# Altium project Audio_Moduloop.PrjPcb (part 1 of 2)
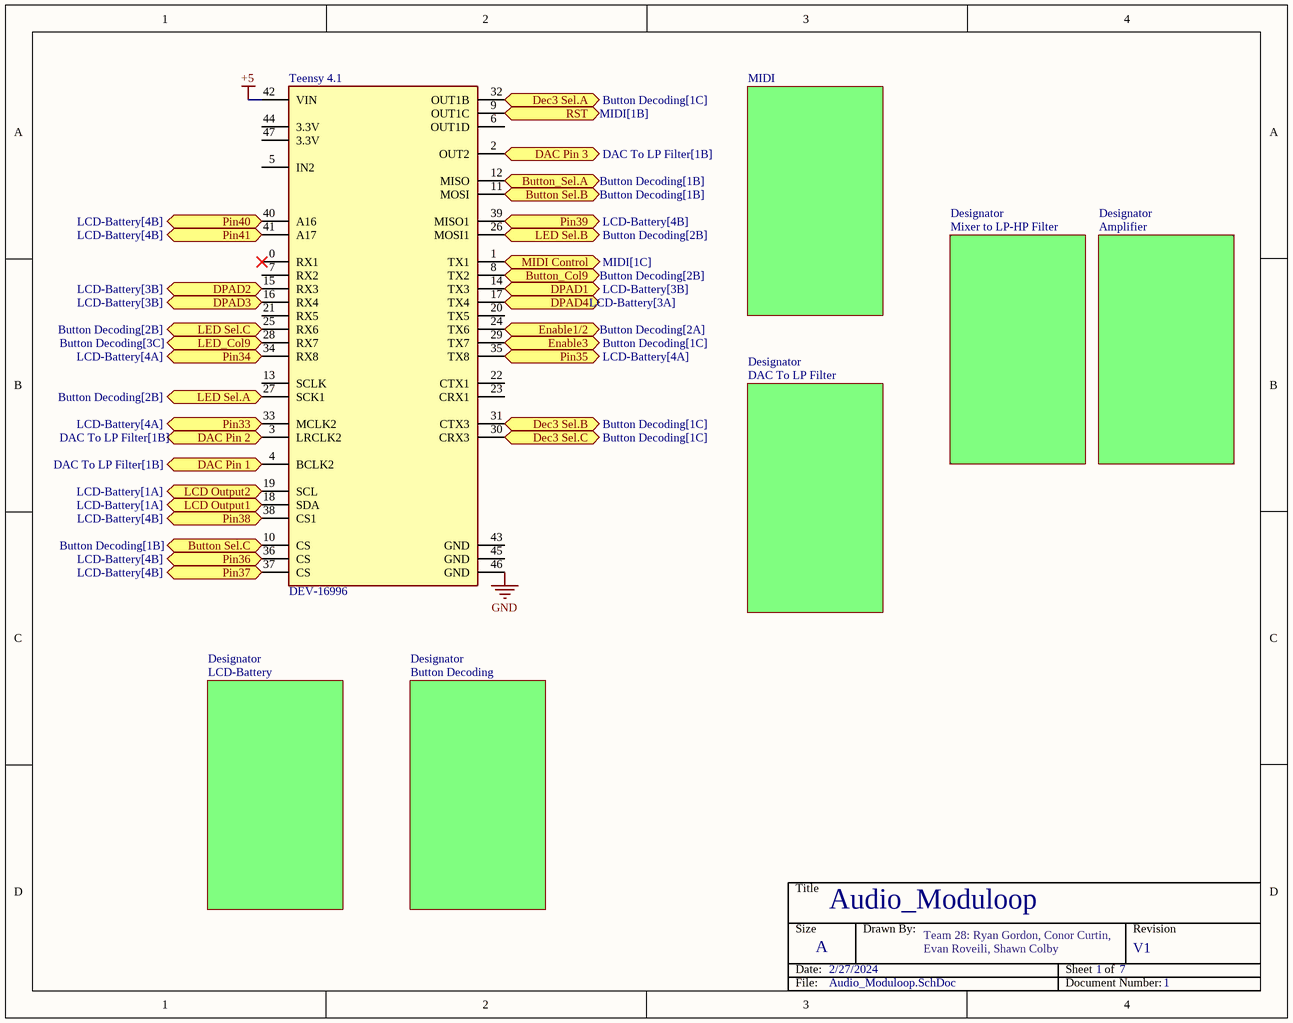
[diagram p0: Audio_Moduloop.SchDoc]
7 sheets, 101 parts. Net scope: flat (ports and power ports of the same name join across sheets).
Board file: Audio_PCB.PcbDoc
Sheets:
  Audio_Moduloop.SchDoc
    MIDI = MIDI.SchDoc
    Designator = Amplifier.SchDoc
    Designator = DAC To LP Filter.SchDoc
    Designator = Button Decoding.SchDoc
    Designator = LCD-Battery.SchDoc
    Designator = Mixer to LP-HP Filter.SchDoc

## Sheet Audio_Moduloop.SchDoc: Audio_Moduloop
size A; Date: 2/27/2024; DrawnBy: Team 28: Ryan Gordon, Conor Curtin, Evan Roveili, Shawn Colby; DocumentNumber: 1; Revision: V1; SheetNumber: 1; SheetTotal: 7

### Parts
Teensy_4.1  DEV-16996  [FP-DEV-16996-MFG]

### Sub-sheets
Designator = Amplifier: no entries
Designator = DAC To LP Filter: no entries
Designator = Button Decoding: no entries
Designator = LCD-Battery: no entries
Designator = Mixer to LP-HP Filter: no entries
MIDI = MIDI: no entries

### Ports
Button Sel.B (bidir, see Button Decoding[1B]), Button Sel.C (bidir, see Button Decoding[1B]), Button_Col9 (bidir, see Button Decoding[2B]), Button_Sel.A (bidir, see Button Decoding[1B]), DAC Pin 1 (bidir, see DAC To LP Filter[1B]), DAC Pin 2 (bidir, see DAC To LP Filter[1B]), DAC Pin 3 (bidir, see DAC To LP Filter[1B]), Dec3 Sel.A (bidir, see Button Decoding[1C]), Dec3 Sel.B (bidir, see Button Decoding[1C]), Dec3 Sel.C (bidir, see Button Decoding[1C]), DPAD1 (bidir, see LCD-Battery[3B]), DPAD2 (bidir, see LCD-Battery[3B]), DPAD3 (bidir, see LCD-Battery[3B]), DPAD4 (bidir, see LCD-Battery[3A]), Enable1/2 (bidir, see Button Decoding[2A]), Enable3 (bidir, see Button Decoding[1C]), LCD Output1 (bidir, see LCD-Battery[1A]), LCD Output2 (bidir, see LCD-Battery[1A]), LED Sel.A (bidir, see Button Decoding[2B]), LED Sel.B (bidir, see Button Decoding[2B]), LED Sel.C (bidir, see Button Decoding[2B]), LED_Col9 (bidir, see Button Decoding[3C]), MIDI Control (bidir, see MIDI[1C]), Pin33 (bidir, see LCD-Battery[4A]), Pin34 (bidir, see LCD-Battery[4A]), Pin35 (bidir, see LCD-Battery[4A]), Pin36 (bidir, see LCD-Battery[4B]), Pin37 (bidir, see LCD-Battery[4B]), Pin38 (bidir, see LCD-Battery[4B]), Pin39 (bidir, see LCD-Battery[4B]), Pin40 (bidir, see LCD-Battery[4B]), Pin41 (bidir, see LCD-Battery[4B]), RST (bidir, see MIDI[1B])

### Nets
+5: Teensy_4.1.42(VIN)
GND: Teensy_4.1.46(GND)
NetBut._Col_9: Teensy_4.1.8(TX2) ; port Button_Col9
NetDec1_1: Teensy_4.1.12(MISO) ; port Button_Sel.A
NetDec1_2: Teensy_4.1.11(MOSI) ; port Button Sel.B
NetDec1_3: Teensy_4.1.10(CS) ; port Button Sel.C
NetDec1_6: Teensy_4.1.24(TX6) ; port Enable1/2
NetDec2_1: Teensy_4.1.27(SCK1) ; port LED Sel.A
NetDec2_2: Teensy_4.1.26(MOSI1) ; port LED Sel.B
NetDec2_3: Teensy_4.1.25(RX6) ; port LED Sel.C
NetDec3_1: Teensy_4.1.32(OUT1B) ; port Dec3 Sel.A
NetDec3_2: Teensy_4.1.31(CTX3) ; port Dec3 Sel.B
NetDec3_3: Teensy_4.1.30(CRX3) ; port Dec3 Sel.C
NetDec3_6: Teensy_4.1.29(TX7) ; port Enable3
NetLCD1_1: Teensy_4.1.19(SCL) ; port LCD Output2
NetLCD1_2: Teensy_4.1.18(SDA) ; port LCD Output1
NetLED_Col_9: Teensy_4.1.28(RX7) ; port LED_Col9
NetMenu_Input_5: Teensy_4.1.17(TX4) ; port DPAD4
NetMenu_Input_6: Teensy_4.1.16(RX4) ; port DPAD3
NetMenu_Input_7: Teensy_4.1.15(RX3) ; port DPAD2
NetMenu_Input_8: Teensy_4.1.14(TX3) ; port DPAD1
NetMIDI_Chip_1: Teensy_4.1.9(OUT1C) ; port RST
NetMIDI_Chip_15: Teensy_4.1.1(TX1) ; port MIDI Control
NetPT2811_1: Teensy_4.1.4(BCLK2) ; port DAC Pin 1
NetPT2811_2: Teensy_4.1.3(LRCLK2) ; port DAC Pin 2
NetPT2811_3: Teensy_4.1.2(OUT2) ; port DAC Pin 3
NetTeensy_4.1_33: Teensy_4.1.33(MCLK2) ; port Pin33
NetTeensy_4.1_34: Teensy_4.1.34(RX8) ; port Pin34
NetTeensy_4.1_35: Teensy_4.1.35(TX8) ; port Pin35
NetTeensy_4.1_36: Teensy_4.1.36(CS) ; port Pin36
NetTeensy_4.1_37: Teensy_4.1.37(CS) ; port Pin37
NetTeensy_4.1_38: Teensy_4.1.38(CS1) ; port Pin38
NetTeensy_4.1_39: Teensy_4.1.39(MISO1) ; port Pin39
NetTeensy_4.1_40: Teensy_4.1.40(A16) ; port Pin40
NetTeensy_4.1_41: Teensy_4.1.41(A17) ; port Pin41

Not connected (* = marked no-connect by the designer): Teensy_4.1 0(RX1)* 5(IN2) 6(OUT1D) 7(RX2) 13(SCLK) 20(TX5) 21(RX5) 22(CTX1) 23(CRX1) 43(GND) 44(3.3V) 45(GND) 47(3.3V)

### Notes on the sheet
- Title
- Size
- Date:
- A
- Drawn By:
- Sheet    of
- Revision
- File:
- Document Number:

### Library data of the parts
Teensy_4.1 = CMP-157412-000001-1: TEENSY 4.1 (HEADERS)

## Sheet MIDI.SchDoc: Audio_Moduloop - MIDI
size A; Date: 2/27/2024; DrawnBy: Team 28: Ryan Gordon, Conor Curtin, Evan Roveili, Shawn Colby; DocumentNumber: 2; Revision: V1; SheetNumber: 2; SheetTotal: 7
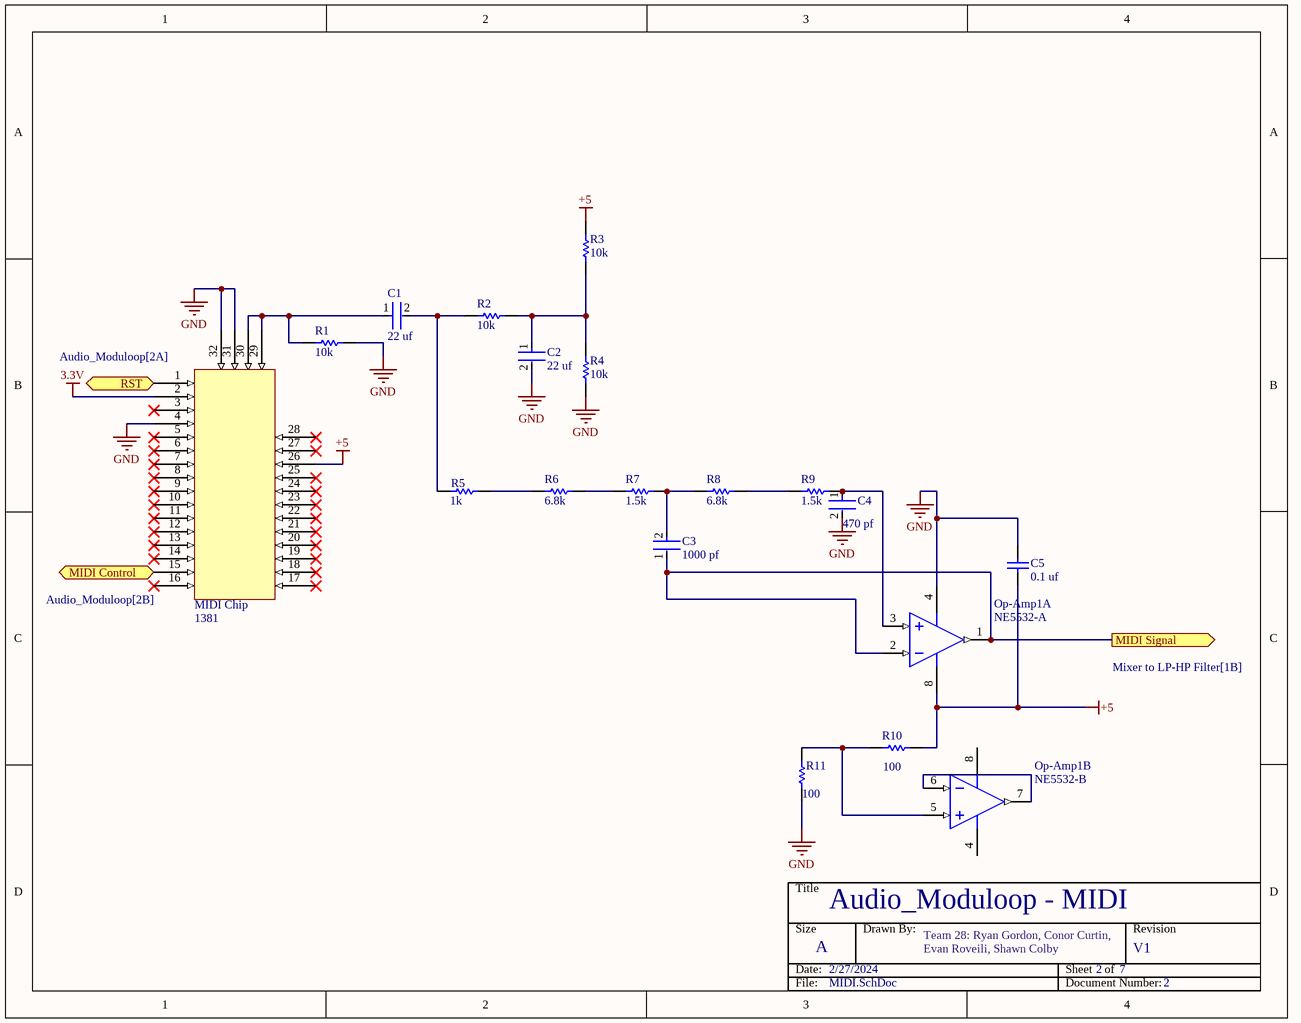
[diagram p1: MIDI.SchDoc]

### Parts
C1  22 uf  [FP-RCEWM1-MFG]
C2  22 uf  [FP-RCEWM1-MFG]
C3  1000 pf  [FP-VY1102M35Y5UQ6TV0-MFG]
C4  470 pf  [FP-F471K33Y5RP6UK5R-MFG]
C5  0.1 uf  [AVX-SA115C104KAR]
MIDI_Chip  1381  [FEATHERWING]
Op-Amp1  NE5532-A  [ONSC-SOIC-8-751-07_V]  (parts A,B of 2)
R1  10k  [RESC2013X60X35NL10T20]
R2  10k  [RESC2013X60X35NL10T20]
R3  10k  [RESC2013X60X35NL10T20]
R4  10k  [RESC2013X60X35NL10T20]
R5  1k  [RESC2013X70X40ML20T20]
R6  6.8k  [RESC2013X70X40LL20T20]
R7  1.5k  [RESC2013X60X40LL20T25]
R8  6.8k  [RESC2013X70X40LL20T20]
R9  1.5k  [RESC2013X60X40LL20T25]
R10  100  [RESC2013X60X40ML20T25]
R11  100  [RESC2013X60X40ML20T25]

### Ports
MIDI Control (bidir, see Audio_Moduloop[2B]), MIDI Signal (out, see Mixer to LP-HP Filter[1B]), RST (bidir, see Audio_Moduloop[2A])

### Nets
3.3V: MIDI_Chip.2
+5: C5.1 MIDI_Chip.26 Op-Amp1.8(V+) R3.1 R10.2
GND: C2.2 C4.2 C5.2 MIDI_Chip.4 MIDI_Chip.31 MIDI_Chip.32 Op-Amp1.4(V-) R1.2 R4.2 R11.1
NetC1_1: C1.1 MIDI_Chip.29 MIDI_Chip.30 R1.1
NetC1_2: C1.2 R2.1 R5.1
NetC2_1: C2.1 R2.2 R3.2 R4.1
NetC3_1: C3.1 Op-Amp1.1(OUTA) Op-Amp1.2(INA-) ; port MIDI Signal
NetC3_2: C3.2 R7.2 R8.1
NetC4_1: C4.1 Op-Amp1.3(INA+) R9.2
NetMIDI_Chip_1: MIDI_Chip.1 ; port RST
NetMIDI_Chip_15: MIDI_Chip.15 ; port MIDI Control
NetOp-Amp1_5: Op-Amp1.5(INB+) R10.1 R11.2
NetOp-Amp1_6: Op-Amp1.6(INB-) Op-Amp1.7(OUTB)
NetR5_2: R5.2 R6.1
NetR6_2: R6.2 R7.1
NetR8_2: R8.2 R9.1

Not connected (* = marked no-connect by the designer): MIDI_Chip 3* 5* 6* 7* 8* 9* 10* 11* 12* 13* 14* 16* 17* 18* 19* 20* 21* 22* 23* 24* 25* 27* 28*

### Notes on the sheet
- Title
- Size
- Date:
- A
- Drawn By:
- Sheet    of
- Revision
- File:
- Document Number:

### Library data of the parts
C1 C2 = CMP-06035-003622-1: CAP CER 22UF 25V X7R RADIAL; Tolerance: 20%; Lead Diameter: 0.5mm; Lead/Base Style: Formed Leads; Height - Seated (Max): 0.295inch; Height: 7.5mm; Capacitance: 22uF; Max Operating Temperature: 125°C; Package Quantity: 1500; Case/Package: Radial; Length: 0.217inch; Lead Pitch: 0.197inch; Voltage Rating (DC): 25V; Ratings: AEC-Q200; Mount: Through Hole; Packaging: Tape and Reel; Voltage Rating: 25V; Min Operating Temperature: -55°C; Width: 0.157inch; Resistor Type: Ceramic; Termination: Radial; Dielectric: X7R
C3 = CMP-02417-000063-1: CAP CER 1000PF 760VAC Y5U RADIAL; Voltage: 500V; Capacitance: 1nF; Lead Diameter: 0.6mm; Lead/Base Style: Kinked; Tolerance: 20%; Construction: RADIAL; Dielectric: Y5U; RoHS Compliant: Yes; Resistor Type: Ceramic; Min Operating Temperature: -40°C; Height - Seated (Max): 0.512inch; Series: VY1; Diameter: 9mm; Voltage Rating (AC): 500V; Termination: Radial; Depth: 5mm; Radiation Hardening: No; Lead Pitch: 10mm; Package Quantity: 500; Case/Package: Radial; Height: 12mm; Contact Plating: Tin; Voltage Rating (DC): 500V; Max Operating Temperature: 125°C; Packaging: Tape and Reel; Mount: Through Hole
C4 = CMP-02417-000080-1: CAP CER 470PF 2KV Y5R RADIAL; Tolerance: 10%; Dielectric Material: Ceramic; Insulation Resistance: 10GR; Lead/Base Style: Kinked; Lead Diameter: 0.8mm; Series: F; Depth: 5mm; Package Quantity: 1500; Resistor Type: Ceramic; Construction: RADIAL; Min Operating Temperature: -30°C; Mount: Through Hole; Radiation Hardening: No; Voltage: 2kV; Voltage Rating: 2kV; Max Operating Temperature: 125°C; Termination: Radial; RoHS Compliant: Yes; Lead Pitch: 5mm; Capacitance: 470pF; Packaging: Tape and Reel; Length: 8.5mm; Case/Package: Radial; Dielectric: Y5R
C5 = CMP-2000-07029-1: Axial Leads / SpinGuard(R), Ceramic Capacitor, 0.10 uF +/- 10%, 50V, -55 to 125 degC, 2-Pin THD, RoHS, Tape and Reel; Manufacturer: AVX; Other Names: 478-3151-1; Catalog Drawings: SASeries_4.32x3.05; Capacitance: 0.1µF; Temperature Coefficient: X7R; Online Catalog: SpinGuard®SASeries; Product Training Modules: ComponentSolutionsforSmartMeterApplications; Category: Capacitors; Package Description: 2-Pin Axial Lead, Dia 3.05 mm, Body Length 4.32 mm; Standard Package: 1; Mounting Technology: ThroughHole; Ratings: -; Datasheet Version: 06/2007; Voltage - Rated: 50V; Tolerance: ±10%; Package Reference: SA115C104KAR; Packaging: -; Lead Style: -; Size / Dimension: 0.120"Diax0.170"L(3.05mmx4.32mm); Mounting Type: ThroughHole; Operating Temperature: -55°C~125°C; Datasheet URL: https://datasheet.ciiva.com/27051/1074183-27051369.pdf; Applications: GeneralPurpose; Thickness (Max): -; Lead Spacing: -; Height - Seated (Max): -; Family: CeramicCapacitors; Package / Case: Axial; Features: -; Series: SpinGuard®SA; Manufacturer URL: http://www.avx.com/
MIDI_Chip = CMP-00030-00003-3: Conn, Rect, PowerPoleHousing, PP180Series, Blue, 180A, 600V; Pins: 32
Op-Amp1 = CMP-1310-00252-1: Internally Compensated Dual Low Noise Operational Amplifier, 6 to 40 V, 0 to 70 degC, 8-Pin SOIC, Pb-Free, Tape and Reel; Manufacturer: On Semiconductor; PartNumber: NE5532AD8R2G; SR Typ (V/uS): 9; VCC Min (V): 6; VCC Max (V): 40; GBW Typ (MHz): 10; PackageVersion: Rev. AK, 02/2011; ComponentLink2URL: http://www.onsemi.cn/pub_link/Collateral/NE5532-D.PDF; RoHS: TRUE; PackageReference: SOIC-8-751-07; ComponentLink2Description: Datasheet; PackageDescription: 8-Pin Small Outline Integrated Circuit, Body 4.9 x 3.9 mm, Pitch 1.27 mm; ComponentLink3URL: http://www.onsemi.com/pub_link/Collateral/751-07.PDF; ComponentLink1Description: Manufacturer URL; DatasheetVersion: Rev. 2; Packing: Tape and Reel; ComponentLink1URL: http://www.onsemi.com/; ComponentLink3Description: Package Specification; Mounting Technology: Surface Mount
R1-R4 = CMP-1659-00013-4: Chip Resistor, 10 KOhm, +/- 1%, 0.125 W, -55 to 155 degC, 0805 (2012 Metric), RoHS, Tape and Reel; Manufacturer: Yageo; Voltage Rating: 150 V; Mount: Surface Mount; ComponentLink1Description: Manufacturer URL; ComponentLink2URL: http://www.yageo.com/documents/recent/PYu-RC_Group_51_RoHS_L_04.pdf; Pins: 2; Length: 2 mm; Min Operating Temperature: -55 degC; Height: 0.5 mm; Mounting Technology: Surface Mount; RoHSCompliant: true; REACH SVHC: No SVHC; ComponentLink1URL: http://www.yageo.com/; Max Operating Temperature: 155 degC; PackageReference: 0805; DatasheetVersion: Rev. 4, 02/2016; Package Quantity: 5000; Packaging: Tape and Reel; ComponentLink2Description: Datasheet; PackageDescription: 2-Pin Surface Mounted Device, Body 2 x 1.25 mm
R5 = CMP-2001-04375-5: Chip Resistor, 1 KOhm, +/- 1%, 0.125 W, -55 to 155 degC, 0805 (2012 Metric), RoHS, Tape and Reel; Manufacturer: Panasonic; Voltage Rating: 150 V; ComponentLink1URL: http://www.panasonic.com/; ComponentLink2Description: Datasheet; REACH SVHC: Yes; ComponentLink1Description: Manufacturer URL; Length: 2 mm; Height: 0.6 mm; Package Quantity: 1; PackageDescription: 2-Pin Surface Mount Device, Body 2 x 1.25 mm; Packaging: Cut Tape; PackageReference: 0805; Max Operating Temperature: 155 degC; Mounting Technology: Surface Mount; ComponentLink2URL: http://industrial.panasonic.com/cdbs/www-data/pdf/RDA0000/AOA0000C86.pdf; DatasheetVersion: 04/2015; Min Operating Temperature: -55 degC; RoHSCompliant: true; Mount: Surface Mount
R6 R8 = CMP-2001-00567-1: Manufacturer: Panasonic; Part Number: ERJ6ENF6801V
R7 R9 = CMP-2001-00597-1: Manufacturer: Panasonic; Part Number: ERA6AEB152V
R10 R11 = CMP-2001-00580-1: Manufacturer: Panasonic; Part Number: ERA6AEB101V

## Sheet Amplifier.SchDoc: Audio_Moduloop - Amplifier
size A; Date: 2/27/2024; DrawnBy: Team 28: Ryan Gordon, Conor Curtin, Evan Roveili, Shawn Colby; DocumentNumber: 5; Revision: V1; SheetNumber: 5; SheetTotal: 7
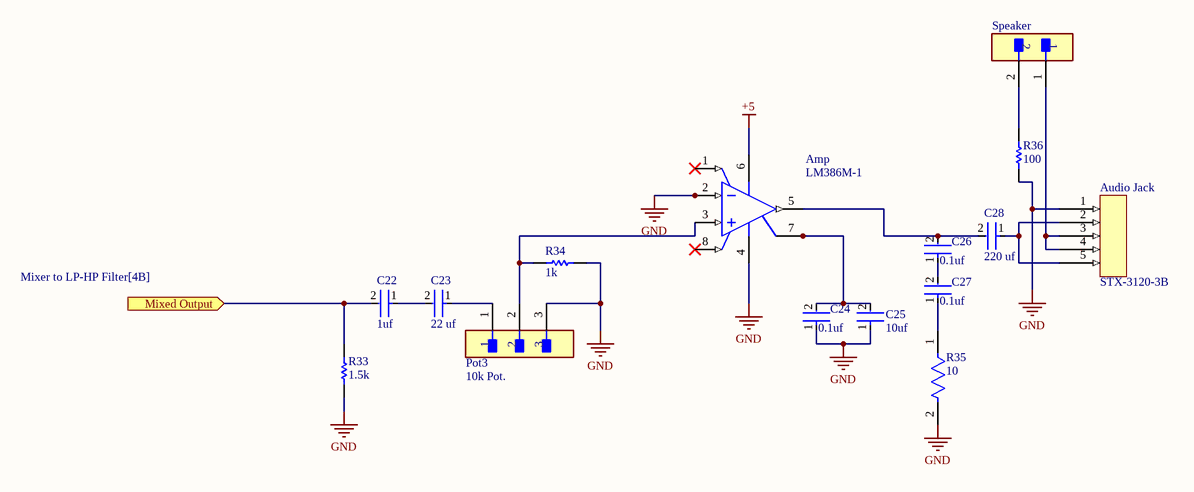
[diagram p2: Amplifier.SchDoc]

### Parts
Amp  LM386M-1  [TI-D8_M]
Audio_Jack  STX-3120-3B  [STX3100]
C22  1uf  [FP-K105Z20Y5VF5TL2-MFG]
C23  22 uf  [FP-RCEWM1-MFG]
C24  0.1uf  [FP-SR20-MFG]
C25  10uf  [FP-RCE3DB-MFG]
C26  0.1uf  [FP-SR20-MFG]
C27  0.1uf  [FP-SR20-MFG]
C28  220 uf  [FP-RCEWM1-MFG]
Pot3  10k Pot.  [FP-90120-0123-MFG]
R33  1.5k  [RESC2013X60X40LL20T25]
R34  1k  [RESC2013X70X40ML20T20]
R35  10  [FP-RN732A-MFG]
R36  100  [RESC2013X60X40ML20T25]
Speaker  M20-9990246  [FP-M20-9990246-MFG]  (value not drawn)

### Ports
Mixed Output (in, see Mixer to LP-HP Filter[4B])

### Nets
+5: Amp.6(VS)
GND: Amp.2(IN-) Amp.4(GND) Audio_Jack.1 C24.1 C25.1 Pot3.3 R33.1 R34.2 R35.2 R36.1
NetAmp_3: Amp.3(IN+) Pot3.2 R34.1
NetAmp_5: Amp.5(VOUT) C26.2 C28.2
NetAmp_7: Amp.7(BYPASS) C24.2 C25.2
NetAudio_Jack_2: Audio_Jack.2 Audio_Jack.5 C28.1
NetAudio_Jack_3: Audio_Jack.3 Audio_Jack.4 Speaker.1
NetC22_1: C22.1 C23.2
NetC22_2: C22.2 R33.2 ; port Mixed Output
NetC23_1: C23.1 Pot3.1
NetC26_1: C26.1 C27.2
NetC27_1: C27.1 R35.1
NetR36_2: R36.2 Speaker.2

Not connected (* = marked no-connect by the designer): Amp 1(GAIN)* 8(GAIN)*

### Notes on the sheet
- Title
- Size
- Date:
- A
- Drawn By:
- Sheet    of
- Revision
- File:
- Document Number:

### Library data of the parts
Amp = CMP-0994-00001-1: Low Voltage Audio Power Amplifier, 0 to 70 degC, 8-pin SOIC (D8), Green (RoHS & no Sb/Br); PartNumber: LM386M-1/NOPB; Manufacturer: Texas Instruments; Input Type: Analog; SubFamily: Mid/High-Power Amplifier; Max. Number of Speaker Outputs: 1; PackageVersion: 4040047-3/M, 06/2011; ComponentLink2Description: Datasheet; DatasheetVersion: SNAS545A; ComponentLink3URL: http://www.ti.com/litv/pdf/msoi002j; ComponentLink1URL: http://www.ti.com/; Mounting Technology: Surface Mount; Eco-Plan: Green (RoHS & no Sb/Br); ComponentLink3Description: Package Specification; ComponentLink2URL: http://www.ti.com/general/docs/lit/getliterature.tsp?genericPartNumber=LM386&fileType=pdf; PackageDescription: 8-Pin Plastic Small Outline, Body 4.9 x 3.9 mm, Pitch 1.27 mm; ComponentLink1Description: Manufacturer URL; Code_JEDEC: MS-012; PackageReference: D8
Audio_Jack = CMP-00027-00002-2: 3 Pole(s), Female, Solder Terminal, Locking, Jack; Min Operating Temperature: -25°C; Mounting Technology: Board; Max Operating Temperature: 85°C; RoHS Compliant: Yes
C22 = CMP-02417-000003-1: CAP CER 1UF 50V Y5V RADIAL; Manufacturer Part Number: K105Z20Y5VF5TL2; Manufacturer: Vishay BC Components; Tolerance: -20+80%; Material: Ceramic; Capacitance: 1uF; Temperature Characteristic: Y5V; Mouser Description: Multilayer Ceramic Capacitors MLCC - Leaded 1uF 50volts +80/-20% Y5V 2.5mm LS; Lead Free: Yes; RoHS: TRUE; Voltage Rating: 50V; Device Class L1: Passive Components; Octopart: https://octopart.com/k105z20y5vf5tl2-vishay-39475252; Temperature Range Low: -30°C; Digikey Description: CAP CER 1UF 50V Y5V RADIAL; Device Class L2: Capacitors; Temperature: -30°C to +85°C; Package: K105Z20Y5VF5TL2; Temperature Range High: +85°C; ComponentLink2Description: Datasheet; Value: 1uF; Category: Cap; Height: 6.6mm; ComponentLink2URL: https://www.vishay.com/docs/45171/kseries.pdf; Device Class L3: Ceramic Capacitors; Automotive: No
C23 C28 = CMP-06035-003622-1: as C1 on sheet MIDI; Height - Seated (Max): 0.295inch; Height: 7.5mm; Capacitance: 22uF; Max Operating Temperature: 125°C; Package Quantity: 1500; Case/Package: Radial; Length: 0.217inch; Lead Pitch: 0.197inch; Voltage Rating (DC): 25V; Ratings: AEC-Q200; Mount: Through Hole; Packaging: Tape and Reel; Voltage Rating: 25V; Min Operating Temperature: -55°C; Width: 0.157inch; Resistor Type: Ceramic; Termination: Radial; Dielectric: X7R
C24 C26 C27 = CMP-04427-000013-1: CAP CER 0.1UF 50V X7R RADIAL; Manufacturer Part Number: SR205C104KAR; Manufacturer: AVX; Material: Ceramic; Tolerance: 10%; Capacitance: 100nF; Value: 100nF; Voltage: 50V; Height: 5.08mm; Digikey Description: CAP CER 0.1UF 50V X7R RADIAL; Device Class L2: Capacitors; ComponentLink2URL: http://datasheets.avx.com/SR-Series.pdf; Temperature Range High: +125°C; Lead Free: Yes; Category: Cap; Device Class L1: Passive Components; Temperature: -55°C to +125°C; Voltage Rating: 50V; ComponentLink2Description: Datasheet; RoHS: TRUE; Automotive: No; Octopart: https://octopart.com/sr205c104kar-avx-145048; Mouser Description: Multilayer Ceramic Capacitors MLCC - Leaded 50volts 0.1uF 10% X7R; Temperature Characteristic: X7R; Device Class L3: Ceramic Capacitors; Temperature Range Low: -55°C; Package: SR20
C25 = CMP-06035-005830-1: Cap Ceramic 10uF 25V X7R ±10% Radial 2.5mm +125°C Automotive Ammo Pack; Lead/Base Style: Straight; Lead Diameter: 0.5mm; Case/Package: Radial; Voltage Rating (DC): 25V; Tolerance: 10%; Lead Pitch: 0.098inch; Termination: Radial; Height - Seated (Max): 0.197inch; Resistor Type: Ceramic; Min Operating Temperature: -55°C; Dielectric: X7R; Length: 0.217inch; Voltage Rating: 25V; Width: 0.157inch; Height: 5mm; Packaging: Tape and Reel; Ratings: AEC-Q200; Max Operating Temperature: 125°C; Package Quantity: 1500; Mount: Through Hole; Capacitance: 10uF
Pot3 = CMP-04776-000237-1: CONN HEADER VERT 3POS 2.54MM; Number of Circuits: 3; Max Voltage Rating (DC): 350.35kV; Contact Resistance: 20mR; Gender: Male; Voltage Rating (AC): 350V; Glow Wire Compliant: Non-compliant; Current Rating: 3A; Contact Post Length: 2.9mm; Number of Contacts: 3; Number of Rows: 1; Max Operating Temperature: 125°C; Orientation: Vertical; Number of Positions: 3; Packaging: Tray; Contact Mating Length: 6.75mm; Housing Color: Black; Termination: Solder; Contact Material: Brass; Radiation Hardening: No; Lead Free: Lead Free; Pitch: 2.54mm; RoHS Compliant: Yes; Voltage Rating: 350V; Contact Plating: Tin; Color: Black; Min Operating Temperature: -55°C; Mount: Through Hole; Housing Material: Polyester; Series: 90120; Contact Gender: Male; REACH SVHC: No SVHC
R33 = CMP-2001-00597-1: as R7 on sheet MIDI
R34 = CMP-2001-04375-5: as R5 on sheet MIDI; ComponentLink1URL: http://www.panasonic.com/; ComponentLink2Description: Datasheet; REACH SVHC: Yes; ComponentLink1Description: Manufacturer URL; Length: 2 mm; Height: 0.6 mm; Package Quantity: 1; PackageDescription: 2-Pin Surface Mount Device, Body 2 x 1.25 mm; Packaging: Cut Tape; PackageReference: 0805; Max Operating Temperature: 155 degC; Mounting Technology: Surface Mount; ComponentLink2URL: http://industrial.panasonic.com/cdbs/www-data/pdf/RDA0000/AOA0000C86.pdf; DatasheetVersion: 04/2015; Min Operating Temperature: -55 degC; RoHSCompliant: true; Mount: Surface Mount
R35 = CMP-03211-004731-1: SMD Chip Resistor, Thin Film, 10Ω, 100 V, 0805 [2012 Metric], 100 mW, 0.1%, RN73 Series; Manufacturer: TE Connectivity; Manufacturer Part Number: RN73C2A10RBTG; Power Rating: 0.1W; Temperature Coefficient: 10ppm/°C; Voltage Rating: 100V; Device Class L2: Resistors; octopart_url: https://octopart.com/rn73c2a10rbtg-te+connectivity-21412009; Temperature: -55°C to 155°C; Automotive: No; Temperature Range High: 155°C; Device Class L1: Passive Components; Package: RN732A; Value: 10Ω; Lead Free: Yes; Composition: Thin Film; Ipc Land Pattern Name: RESC200125X55; Resistance: 10Ω; RoHS: TRUE; Height: 0.65mm; Series: RN73; Category: Res; ComponentLink2URL: https://www.te.com/commerce/DocumentDelivery/DDEController?Action=showdoc&DocId=Data+Sheet%7F1773270%7FP%7Fpdf%7FEnglish%7FENG_DS_1773270_P.pdf%7F1676162-2; Device Class L3: Chip SMD Resistors; Octopart: https://octopart.com/rn73c2a10rbtg-te+connectivity-21412009; ComponentLink2Description: Datasheet; Temperature Range Low: -55°C; packaging: 250 cut tape length; Tolerance: 0.1%
R36 = CMP-2001-00580-1: as R10 on sheet MIDI
Speaker = CMP-15831-000009-1: CONN HEADER VERT 2POS 2.54MM; Manufacturer: Harwin; Conn Gender: Male; Conn Orientation: Vertical; Number Of Contacts: 2; Current Rating: 3A; ComponentLink2URL: https://cdn.harwin.com/pdfs/M20-999.pdf; ComponentLink2Description: Datasheet; Package: M20-9990246; Temperature: -40°C to +105°C; Octopart: https://octopart.com/m20-9990246-harwin-2590635; Mouser Description: 2.54mm (0.1") Pitch SIL Vertical PC Tail Pin Header, 6.1mm mating pin height, tin, 2 contacts; Temperature Range High: +105°C; Device Class L1: Connectors; RoHS: TRUE; Automotive: No; Height: 8.99mm; Number Of Rows: 1; Contact Material: Tin,Nickel; Category: Conn; Pitch: 2.54mm; Lead Free: Yes; Digikey Description: CONN HEADER VERT 2POS 2.54MM; Manufacturer Part Number: M20-9990246; Temperature Range Low: -40°C; Device Class L3: unset; Device Class L2: Headers and Wire Housings

## Sheet DAC To LP Filter.SchDoc: Audio_Moduloop - DAC/LP-filter
size A; Date: 2/27/2024; DrawnBy: Team 28: Ryan Gordon, Conor Curtin, Evan Roveili, Shawn Colby; DocumentNumber: 3; Revision: V1; SheetNumber: 3; SheetTotal: 7
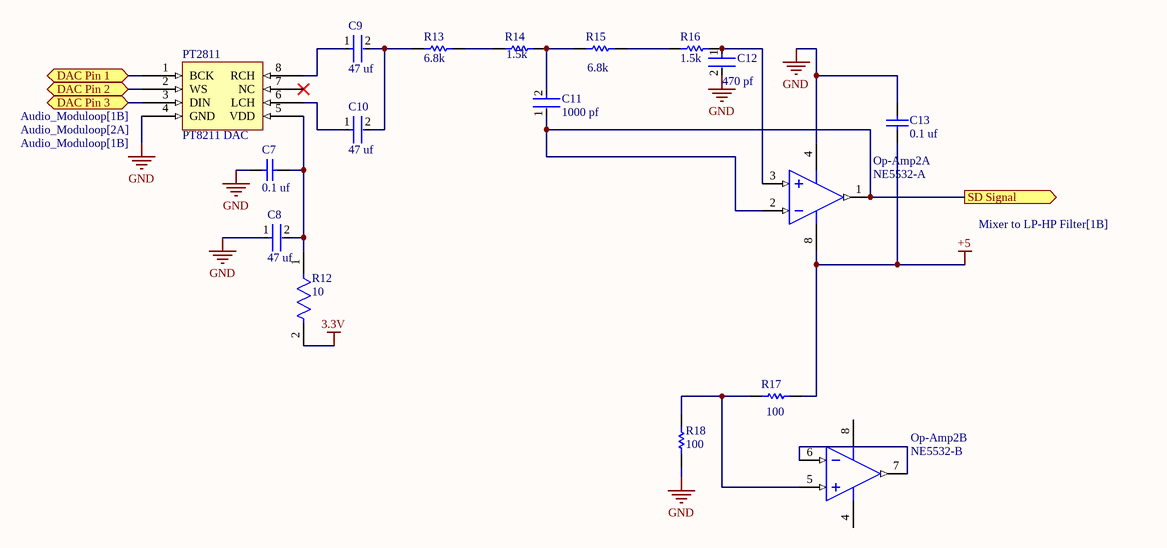
[diagram p3: DAC To LP Filter.SchDoc]

### Parts
C7  0.1 uf  [VISH-K104K15X7RF5TL2]
C8  47 uf  [FP-RCE2A2-MFG]
C9  47 uf  [FP-RCE2A2-MFG]
C10  47 uf  [FP-RCE2A2-MFG]
C11  1000 pf  [FP-VY1102M35Y5UQ6TV0-MFG]
C12  470 pf  [FP-F471K33Y5RP6UK5R-MFG]
C13  0.1 uf  [AVX-SA115C104KAR]
Op-Amp2  NE5532-A  [ONSC-SOIC-8-751-07_V]  (parts A,B of 2)
PT2811  PT8211 DAC  [SOIC127P602X173-8N]
R12  10  [FP-RN732A-MFG]
R13  6.8k  [RESC2013X70X40LL20T20]
R14  1.5k  [RESC2013X60X35LL10T20]
R15  6.8k  [RESC2013X70X40LL20T20]
R16  1.5k  [RESC2013X60X35LL10T20]
R17  100  [RESC2013X60X40ML20T25]
R18  100  [RESC2013X60X40ML20T25]

### Ports
DAC Pin 1 (bidir, see Audio_Moduloop[1B]), DAC Pin 2 (bidir, see Audio_Moduloop[1B]), DAC Pin 3 (bidir, see Audio_Moduloop[2A]), SD Signal (out, see Mixer to LP-HP Filter[1B])

### Nets
3.3V: R12.2
+5: C13.1 Op-Amp2.8(V+) R17.2
GND: C7.2 C8.1 C12.2 C13.2 Op-Amp2.4(V-) PT2811.4(GND) R18.1
NetC7_1: C7.1 C8.2 PT2811.5(VDD) R12.1
NetC9_1: C9.1 PT2811.8(RCH)
NetC9_2: C9.2 C10.2 R13.1
NetC10_1: C10.1 PT2811.6(LCH)
NetC11_1: C11.1 Op-Amp2.1(OUTA) Op-Amp2.2(INA-) ; port SD Signal
NetC11_2: C11.2 R14.2 R15.1
NetC12_1: C12.1 Op-Amp2.3(INA+) R16.2
NetOp-Amp2_5: Op-Amp2.5(INB+) R17.1 R18.2
NetOp-Amp2_6: Op-Amp2.6(INB-) Op-Amp2.7(OUTB)
NetPT2811_1: PT2811.1(BCK) ; port DAC Pin 1
NetPT2811_2: PT2811.2(WS) ; port DAC Pin 2
NetPT2811_3: PT2811.3(DIN) ; port DAC Pin 3
NetR13_2: R13.2 R14.1
NetR15_2: R15.2 R16.1

Not connected (* = marked no-connect by the designer): PT2811 7(NC)*

### Notes on the sheet
- Title
- Size
- Date:
- A
- Drawn By:
- Sheet    of
- Revision
- File:
- Document Number:

### Library data of the parts
C7 = CMP-2000-06508-1: Ceramic Capacitor, 100 nF, +/- 10%, 50 V, -55 to 125 degC, 2-Pin THD, RoHS, Tape and Reel; Manufacturer: Vishay; Other Names: BC1084CT; Catalog Drawings: Mono-KapSide2-15_5.58Mono-KapSide1_15; Temperature Coefficient: X7R; Voltage - Rated: 50V; Online Catalog: Mono-Kap™Series; Capacitance: 0.1µF; Size / Dimension: 0.157"Lx0.098"W(4.00mmx2.50mm); Operating Temperature: -55°C~125°C; Family: CeramicCapacitors; Manufacturer URL: http://www.vishay.com/; Standard Package: 1; Thickness (Max): -; Ratings: -; Datasheet Version: 08/2013; Package Description: 2-Pin Through Hole Device, Body 4 x 2.6 mm; Mounting Type: ThroughHole; Features: -; Lead Spacing: 0.098"(2.50mm); Tolerance: ±10%; Category: Capacitors; Mounting Technology: ThroughHole; Lead Style: Straight; Datasheet URL: http://www.vishay.com/docs/45171/kseries.pdf; Applications: GeneralPurpose; Package / Case: Radial; Height - Seated (Max): 0.220"(5.58mm); Package Reference: K104K15X7RF5TL2; Series: Mono-Kap™K; Packaging: CutTape(CT)
C8-C10 = CMP-06035-022497-1: Cap Ceramic 4.7uF 25V X7R ±10% Radial 2.5mm +125°C Automotive Ammo Pack; Lead/Base Style: Straight; Lead Diameter: 0.5mm; Height - Seated (Max): 0.157inch; Voltage Rating (DC): 25V; Height: 4mm; Length: 0.217inch; Max Operating Temperature: 125°C; Ratings: AEC-Q200; Dielectric: X7R; Resistor Type: Ceramic; Packaging: Tape and Reel; Tolerance: 10%; Termination: Radial; Min Operating Temperature: -55°C; Case/Package: Radial; Width: 0.124inch; Lead Pitch: 0.098inch; Package Quantity: 2000; Voltage Rating: 25V; Mount: Through Hole; Capacitance: 4.7uF
C11 = CMP-02417-000063-1: as C3 on sheet MIDI; Construction: RADIAL; Dielectric: Y5U; RoHS Compliant: Yes; Resistor Type: Ceramic; Min Operating Temperature: -40°C; Height - Seated (Max): 0.512inch; Series: VY1; Diameter: 9mm; Voltage Rating (AC): 500V; Termination: Radial; Depth: 5mm; Radiation Hardening: No; Lead Pitch: 10mm; Package Quantity: 500; Case/Package: Radial; Height: 12mm; Contact Plating: Tin; Voltage Rating (DC): 500V; Max Operating Temperature: 125°C; Packaging: Tape and Reel; Mount: Through Hole
C12 = CMP-02417-000080-1: as C4 on sheet MIDI; Series: F; Depth: 5mm; Package Quantity: 1500; Resistor Type: Ceramic; Construction: RADIAL; Min Operating Temperature: -30°C; Mount: Through Hole; Radiation Hardening: No; Voltage: 2kV; Voltage Rating: 2kV; Max Operating Temperature: 125°C; Termination: Radial; RoHS Compliant: Yes; Lead Pitch: 5mm; Capacitance: 470pF; Packaging: Tape and Reel; Length: 8.5mm; Case/Package: Radial; Dielectric: Y5R
C13 = CMP-2000-07029-1: as C5 on sheet MIDI; Category: Capacitors; Package Description: 2-Pin Axial Lead, Dia 3.05 mm, Body Length 4.32 mm; Standard Package: 1; Mounting Technology: ThroughHole; Ratings: -; Datasheet Version: 06/2007; Voltage - Rated: 50V; Tolerance: ±10%; Package Reference: SA115C104KAR; Packaging: -; Lead Style: -; Size / Dimension: 0.120"Diax0.170"L(3.05mmx4.32mm); Mounting Type: ThroughHole; Operating Temperature: -55°C~125°C; Datasheet URL: https://datasheet.ciiva.com/27051/1074183-27051369.pdf; Applications: GeneralPurpose; Thickness (Max): -; Lead Spacing: -; Height - Seated (Max): -; Family: CeramicCapacitors; Package / Case: Axial; Features: -; Series: SpinGuard®SA; Manufacturer URL: http://www.avx.com/
Op-Amp2 = CMP-1310-00252-1: as Op-Amp1 on sheet MIDI; PackageVersion: Rev. AK, 02/2011; ComponentLink2URL: http://www.onsemi.cn/pub_link/Collateral/NE5532-D.PDF; RoHS: TRUE; PackageReference: SOIC-8-751-07; ComponentLink2Description: Datasheet; PackageDescription: 8-Pin Small Outline Integrated Circuit, Body 4.9 x 3.9 mm, Pitch 1.27 mm; ComponentLink3URL: http://www.onsemi.com/pub_link/Collateral/751-07.PDF; ComponentLink1Description: Manufacturer URL; DatasheetVersion: Rev. 2; Packing: Tape and Reel; ComponentLink1URL: http://www.onsemi.com/; ComponentLink3Description: Package Specification; Mounting Technology: Surface Mount
PT2811 = CMP-015-00008-3
R12 = CMP-03211-004731-1: as R35 on sheet Amplifier; Device Class L2: Resistors; octopart_url: https://octopart.com/rn73c2a10rbtg-te+connectivity-21412009; Temperature: -55°C to 155°C; Automotive: No; Temperature Range High: 155°C; Device Class L1: Passive Components; Package: RN732A; Value: 10Ω; Lead Free: Yes; Composition: Thin Film; Ipc Land Pattern Name: RESC200125X55; Resistance: 10Ω; RoHS: TRUE; Height: 0.65mm; Series: RN73; Category: Res; ComponentLink2URL: https://www.te.com/commerce/DocumentDelivery/DDEController?Action=showdoc&DocId=Data+Sheet%7F1773270%7FP%7Fpdf%7FEnglish%7FENG_DS_1773270_P.pdf%7F1676162-2; Device Class L3: Chip SMD Resistors; Octopart: https://octopart.com/rn73c2a10rbtg-te+connectivity-21412009; ComponentLink2Description: Datasheet; Temperature Range Low: -55°C; packaging: 250 cut tape length; Tolerance: 0.1%
R13 R15 = CMP-2001-00567-1: as R6 on sheet MIDI
R14 R16 = CMP-1659-00010-2: RES 1.50K OHM 1/8W 1% 0805 SMD; Manufacturer: Yageo; PartNumber: RC0805FR-071K5L; PackageReference: 0805; ComponentLink1URL: http://www.yageo.com/documents/recent/PYu-RC_Group_51_RoHS_L_04.pdf; ComponentLink1Description: Datasheet
R17 R18 = CMP-2001-00580-1: as R10 on sheet MIDI

## Sheet Button Decoding.SchDoc: Audio_Moduloop - Decoders
size A; Date: 2/27/2024; DrawnBy: Team 28: Ryan Gordon, Conor Curtin, Evan Roveili, Shawn Colby; DocumentNumber: 6; Revision: V1; SheetNumber: 6; SheetTotal: 7
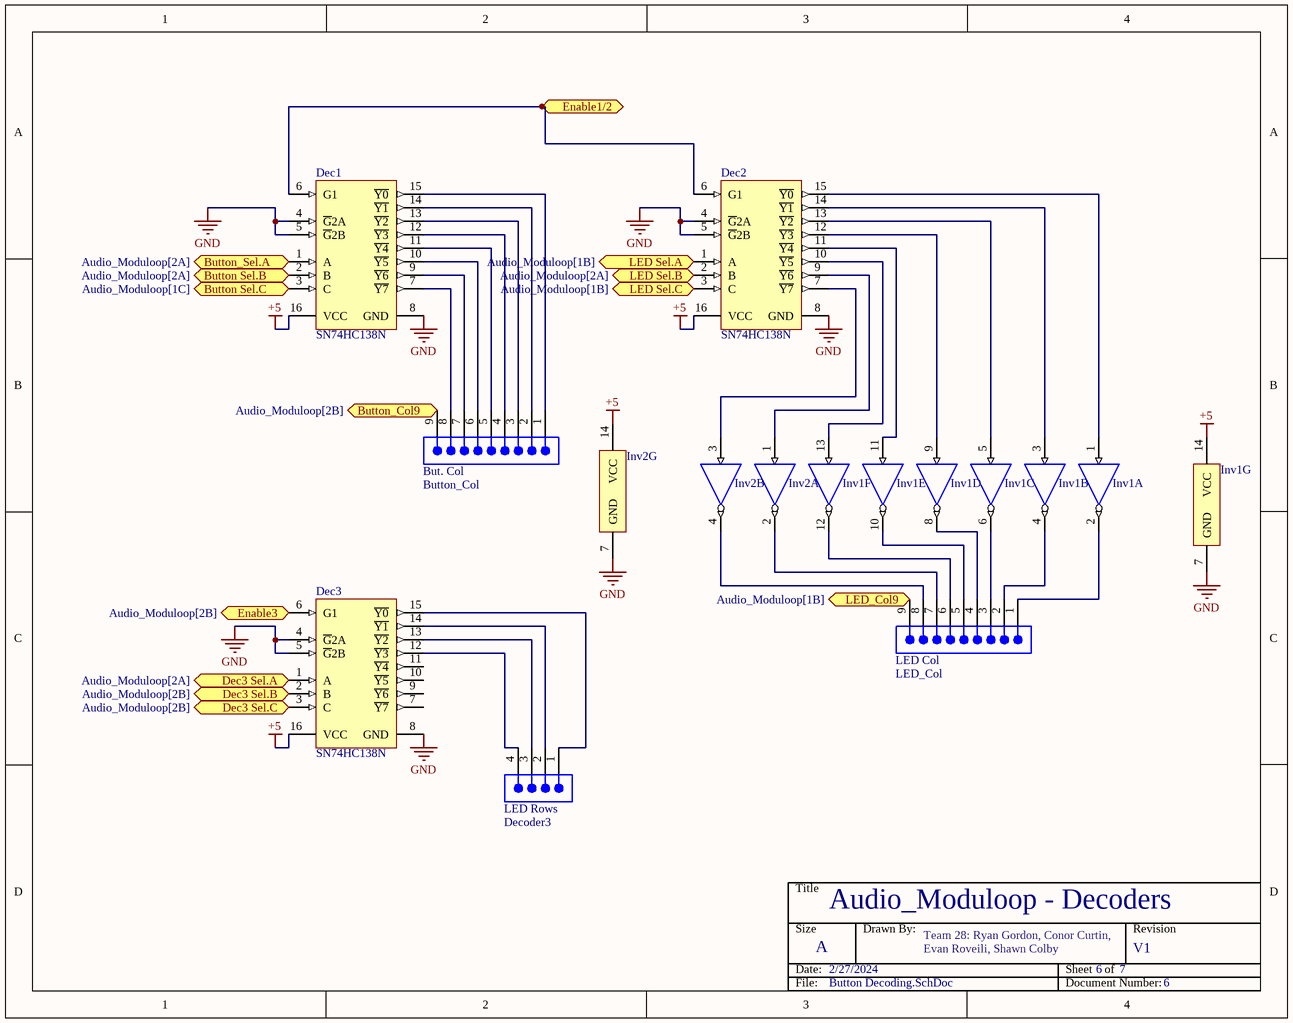
[diagram p4: Button Decoding.SchDoc]

### Parts
But._Col  Button_Col  [61300911121]
Dec1  SN74HC138N  [N0016A]
Dec2  SN74HC138N  [N0016A]
Dec3  SN74HC138N  [N0016A]
Inv1  Inv1  [N0014A]  (value not drawn)  (parts A,B,C,D,E,F,G of 7)
Inv2  Inv2  [N0014A]  (value not drawn)  (parts A,B,G of 7)
LED_Col  LED_Col  [61300911121]
LED_Rows  Decoder3  [61900411121]

### Ports
Button Sel.B (bidir, see Audio_Moduloop[2A]), Button Sel.C (bidir, see Audio_Moduloop[1C]), Button_Col9 (bidir, see Audio_Moduloop[2B]), Button_Sel.A (bidir, see Audio_Moduloop[2A]), Dec3 Sel.A (bidir, see Audio_Moduloop[2A]), Dec3 Sel.B (bidir, see Audio_Moduloop[2B]), Dec3 Sel.C (bidir, see Audio_Moduloop[2B]), Enable1/2 (bidir), Enable3 (bidir, see Audio_Moduloop[2B]), LED Sel.A (bidir, see Audio_Moduloop[1B]), LED Sel.B (bidir, see Audio_Moduloop[2A]), LED Sel.C (bidir, see Audio_Moduloop[1B]), LED_Col9 (bidir, see Audio_Moduloop[1B])

### Nets
+5: Dec1.16(VCC) Dec2.16(VCC) Dec3.16(VCC) Inv1.14(VCC) Inv2.14(VCC)
GND: Dec1.4(~{G}2A) Dec1.5(~{G}2B) Dec1.8(GND) Dec2.4(~{G}2A) Dec2.5(~{G}2B) Dec2.8(GND) Dec3.4(~{G}2A) Dec3.5(~{G}2B) Dec3.8(GND) Inv1.7(GND) Inv2.7(GND)
NetBut._Col_1: But._Col.1 Dec1.15(~{Y0})
NetBut._Col_2: But._Col.2 Dec1.14(~{Y1})
NetBut._Col_3: But._Col.3 Dec1.13(~{Y2})
NetBut._Col_4: But._Col.4 Dec1.12(~{Y3})
NetBut._Col_5: But._Col.5 Dec1.11(~{Y4})
NetBut._Col_6: But._Col.6 Dec1.10(~{Y5})
NetBut._Col_7: But._Col.7 Dec1.9(~{Y6})
NetBut._Col_8: But._Col.8 Dec1.7(~{Y7})
NetBut._Col_9: But._Col.9 ; port Button_Col9
NetDec1_1: Dec1.1(A) ; port Button_Sel.A
NetDec1_2: Dec1.2(B) ; port Button Sel.B
NetDec1_3: Dec1.3(C) ; port Button Sel.C
NetDec1_6: Dec1.6(G1) Dec2.6(G1) ; port Enable1/2
NetDec2_1: Dec2.1(A) ; port LED Sel.A
NetDec2_2: Dec2.2(B) ; port LED Sel.B
NetDec2_3: Dec2.3(C) ; port LED Sel.C
NetDec2_7: Dec2.7(~{Y7}) Inv2.3(2A)
NetDec2_9: Dec2.9(~{Y6}) Inv2.1(1A)
NetDec2_10: Dec2.10(~{Y5}) Inv1.13(6A)
NetDec2_11: Dec2.11(~{Y4}) Inv1.11(5A)
NetDec2_12: Dec2.12(~{Y3}) Inv1.9(4A)
NetDec2_13: Dec2.13(~{Y2}) Inv1.5(3A)
NetDec2_14: Dec2.14(~{Y1}) Inv1.3(2A)
NetDec2_15: Dec2.15(~{Y0}) Inv1.1(1A)
NetDec3_1: Dec3.1(A) ; port Dec3 Sel.A
NetDec3_2: Dec3.2(B) ; port Dec3 Sel.B
NetDec3_3: Dec3.3(C) ; port Dec3 Sel.C
NetDec3_6: Dec3.6(G1) ; port Enable3
NetDec3_12: Dec3.12(~{Y3}) LED_Rows.4
NetDec3_13: Dec3.13(~{Y2}) LED_Rows.3
NetDec3_14: Dec3.14(~{Y1}) LED_Rows.2
NetDec3_15: Dec3.15(~{Y0}) LED_Rows.1
NetInv1_2: Inv1.2(~{1Y}) LED_Col.1
NetInv1_4: Inv1.4(~{2Y}) LED_Col.2
NetInv1_6: Inv1.6(~{3Y}) LED_Col.3
NetInv1_8: Inv1.8(~{4Y}) LED_Col.4
NetInv1_10: Inv1.10(~{5Y}) LED_Col.5
NetInv1_12: Inv1.12(~{6Y}) LED_Col.6
NetInv2_2: Inv2.2(~{1Y}) LED_Col.7
NetInv2_4: Inv2.4(~{2Y}) LED_Col.8
NetLED_Col_9: LED_Col.9 ; port LED_Col9

Not connected (* = marked no-connect by the designer): Dec3 7(~{Y7}) 9(~{Y6}) 10(~{Y5}) 11(~{Y4})

### Notes on the sheet
- Title
- Size
- Date:
- A
- Drawn By:
- Sheet    of
- Revision
- File:
- Document Number:

### Library data of the parts
But._Col LED_Col = CMP-1502-01080-2: NexarPartId: 32855536; Number of Contacts: 9; Current Rating: 3A; Operating Supply Voltage: 250V; Connector Type: Male Pin; Gender: Male; Contact Resistance: 20mΩ; Pitch: 2.54mm; Number of Rows: 1; Number of Pins: 9; Termination: Solder; REACH SVHC: Unknown; Orientation: Vertical; Contact Plating: Gold; Mount: Through Hole; RoHS: Compliant; Number of Positions: 9; Color: Black; Lead Pitch: 2.54mm; Packaging: Bulk; Contact Mating Length: 5.9944mm; Contact Material: Copper
Dec1-Dec3 = CMP-1633-00627-2: 3-Line To 8-Line Decoders/Demultiplexers, N0016A, TUBE; Manufacturer: Texas Instruments; Bits(#): 8; Function: Decoder/Demultiplexer; F @ Nom Voltage(Max)(Mhz): 28; Input Type: LVTTL/CMOS; VCC(Min)(V): 2; VCC(Max)(V): 6; Technology Family: HC; Rating: Catalog; Schmitt Trigger: No; Voltage(Nom)(V): 3.3,5; Output Type: CMOS; Channels(#): 1; Output Drive (IOL/IOH)(Max)(mA): 5.2/-5.2; ICC @ Nom Voltage(Max)(mA): 0.08; tpd @ Nom Voltage(Max)(ns): 45; Configuration: 3：8; DatasheetVersion: SCLS107E; Type: Standard; PackageReference: N0016A; Generic Part Number: SN74HC138; Code_JEDEC: MS-001; Operating Temperature Range(C): -40 to 85
Inv1 Inv2 = CMP-1615-00892-2: Hex Inverters, N0014A, TUBE; Manufacturer: Texas Instruments; Generic Part Number: SN74HC04; VCC(Min)(V): 2; Bits(#): 6; Technology Family: HC; tpd @ Nom Voltage(Max)(ns): 20; Output Drive (IOL/IOH)(Max)(mA): -4/4; Rating: Catalog; Voltage(Nom)(V): 5; Schmitt Trigger: No; ICC @ Nom Voltage(Max)(mA): 0.02; Input Type: CMOS; Code_JEDEC: MS-001; PackageReference: N0014A; DatasheetVersion: SCLS078F; Output Type: CMOS; VCC(Max)(V): 6; Operating Temperature Range(C): -40 to 85; F @ Nom Voltage(Max)(Mhz): 20
LED_Rows = CMP-1502-00586-2: NexarPartId: 18818226; Connector Type: Male Pin; Insulation: Insulated; Number of Positions: 4; Gender: Male; Operating Supply Voltage: 250V; Pitch: 2.54mm; Current Rating: 3A; Insulation Resistance: 1GΩ; Contact Resistance: 20mΩ; Termination: Through Hole; Contact Material: Copper; Height: 3.3mm; Width: 10.2mm; RoHS: Compliant; REACH SVHC: Unknown; Max Operating Temperature: 105°C; Contact Plating: Tin; Lead Free: Lead Free; Contact Gender: Male; Lead Pitch: 2.54mm; Flammability Rating: UL94 V-0; Packaging: Bulk; Housing Material: Nylon; Number of Pins: 4; Number of Contacts: 4; Color: Beige; Number of Rows: 1; Orientation: Vertical; Contact Mating Length: 7.493mm; Mount: Through Hole; Min Operating Temperature: -40°C; Voltage Rating: 250V; Fastening Type: Friction; Length: 10.16mm

## Sheet LCD-Battery.SchDoc: Audio_Moduloop - LCD/Battery
size A; Date: 2/27/2024; DrawnBy: Team 28: Ryan Gordon, Conor Curtin, Evan Roveili, Shawn Colby; DocumentNumber: 7; Revision: V1; SheetNumber: 7; SheetTotal: 7
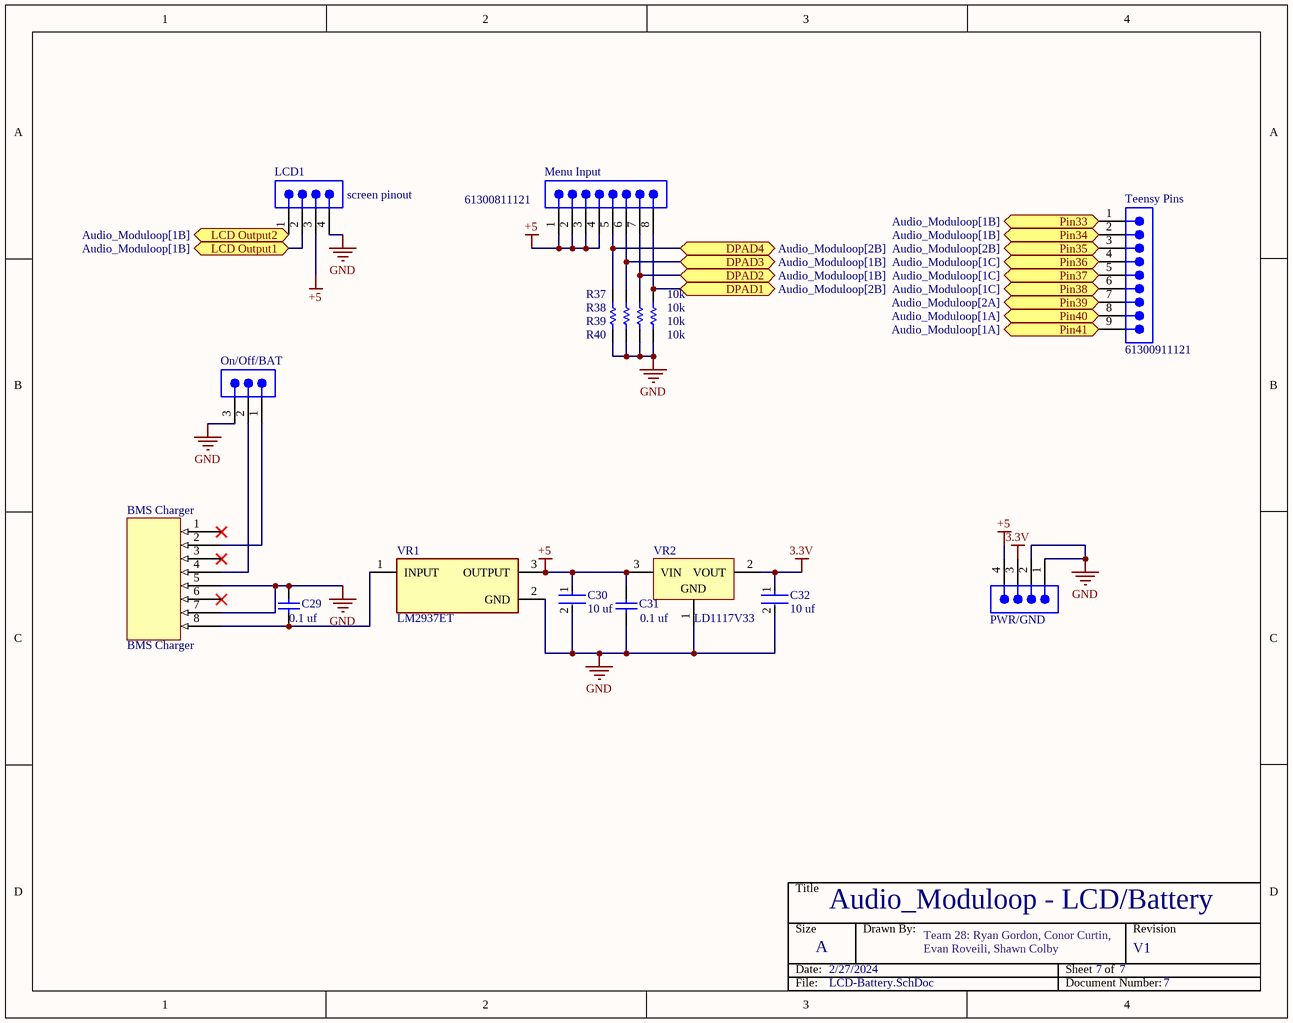
[diagram p5: LCD-Battery.SchDoc]

### Parts
BMS_Charger  BMS Charger  [MODULE_2465]
C29  0.1 uf  [AVX-SA115C104KAR]
C30  10 uf  [FP-RCE3DB-MFG]
C31  0.1 uf  [AVX-SA115C104KAR]
C32  10 uf  [FP-RCE3DB-MFG]
LCD1  screen pinout  [61900411121]
Menu_Input  61300811121  [61300811121]
On/Off/BAT  TSW-103-07-F-S  [SMTC-TSW-103-07-X-S]  (value not drawn)
PWR/GND  61300411121  [61300411121]  (value not drawn)
R37  10k  [RESC2013X60X35NL10T20]
R38  10k  [RESC2013X60X35NL10T20]
R39  10k  [RESC2013X60X35NL10T20]
R40  10k  [RESC2013X60X35NL10T20]
Teensy_Pins  61300911121  [61300911121]
VR1  LM2937ET  [FP-NDE0003B-MFG]
VR2  LD1117V33  [TO220]

### Ports
DPAD1 (bidir, see Audio_Moduloop[2B]), DPAD2 (bidir, see Audio_Moduloop[1B]), DPAD3 (bidir, see Audio_Moduloop[1B]), DPAD4 (bidir, see Audio_Moduloop[2B]), LCD Output1 (bidir, see Audio_Moduloop[1B]), LCD Output2 (bidir, see Audio_Moduloop[1B]), Pin33 (bidir, see Audio_Moduloop[1B]), Pin34 (bidir, see Audio_Moduloop[1B]), Pin35 (bidir, see Audio_Moduloop[2B]), Pin36 (bidir, see Audio_Moduloop[1C]), Pin37 (bidir, see Audio_Moduloop[1C]), Pin38 (bidir, see Audio_Moduloop[1C]), Pin39 (bidir, see Audio_Moduloop[2A]), Pin40 (bidir, see Audio_Moduloop[1A]), Pin41 (bidir, see Audio_Moduloop[1A])

### Nets
3.3V: C32.1 PWR/GND.3 VR2.2(VOUT)
+5: C30.1 C31.2 LCD1.3 Menu_Input.1 Menu_Input.2 Menu_Input.3 Menu_Input.4 PWR/GND.4 VR1.3(OUTPUT) VR2.3(VIN)
GND: BMS_Charger.5 BMS_Charger.7 C29.2 C30.2 C31.1 C32.2 LCD1.4 On/Off/BAT.3 PWR/GND.1 PWR/GND.2 R37.2 R38.2 R39.2 R40.2 VR1.2(GND) VR2.1(GND)
NetBMS_Charger_2: BMS_Charger.2 On/Off/BAT.1
NetBMS_Charger_4: BMS_Charger.4 On/Off/BAT.2
NetBMS_Charger_8: BMS_Charger.8 C29.1 VR1.1(INPUT)
NetLCD1_1: LCD1.1 ; port LCD Output2
NetLCD1_2: LCD1.2 ; port LCD Output1
NetMenu_Input_5: Menu_Input.5 R37.1 ; port DPAD4
NetMenu_Input_6: Menu_Input.6 R38.1 ; port DPAD3
NetMenu_Input_7: Menu_Input.7 R39.1 ; port DPAD2
NetMenu_Input_8: Menu_Input.8 R40.1 ; port DPAD1
NetTeensy_4.1_33: Teensy_Pins.1 ; port Pin33
NetTeensy_4.1_34: Teensy_Pins.2 ; port Pin34
NetTeensy_4.1_35: Teensy_Pins.3 ; port Pin35
NetTeensy_4.1_36: Teensy_Pins.4 ; port Pin36
NetTeensy_4.1_37: Teensy_Pins.5 ; port Pin37
NetTeensy_4.1_38: Teensy_Pins.6 ; port Pin38
NetTeensy_4.1_39: Teensy_Pins.7 ; port Pin39
NetTeensy_4.1_40: Teensy_Pins.8 ; port Pin40
NetTeensy_4.1_41: Teensy_Pins.9 ; port Pin41

Not connected (* = marked no-connect by the designer): BMS_Charger 1* 3* 6*

### Notes on the sheet
- Title
- Size
- Date:
- A
- Drawn By:
- Sheet    of
- Revision
- File:
- Document Number:

### Library data of the parts
BMS_Charger = CMP-00029-00001-2: Holder Battery; AA Battery; 3 Cells; 6 in. Wire Lead; Chassis Mount; Polypropylene
C29 C31 = CMP-2000-07029-1: as C5 on sheet MIDI; Category: Capacitors; Package Description: 2-Pin Axial Lead, Dia 3.05 mm, Body Length 4.32 mm; Standard Package: 1; Mounting Technology: ThroughHole; Ratings: -; Datasheet Version: 06/2007; Voltage - Rated: 50V; Tolerance: ±10%; Package Reference: SA115C104KAR; Packaging: -; Lead Style: -; Size / Dimension: 0.120"Diax0.170"L(3.05mmx4.32mm); Mounting Type: ThroughHole; Operating Temperature: -55°C~125°C; Datasheet URL: https://datasheet.ciiva.com/27051/1074183-27051369.pdf; Applications: GeneralPurpose; Thickness (Max): -; Lead Spacing: -; Height - Seated (Max): -; Family: CeramicCapacitors; Package / Case: Axial; Features: -; Series: SpinGuard®SA; Manufacturer URL: http://www.avx.com/
C30 C32 = CMP-06035-005830-1: as C25 on sheet Amplifier; Case/Package: Radial; Voltage Rating (DC): 25V; Tolerance: 10%; Lead Pitch: 0.098inch; Termination: Radial; Height - Seated (Max): 0.197inch; Resistor Type: Ceramic; Min Operating Temperature: -55°C; Dielectric: X7R; Length: 0.217inch; Voltage Rating: 25V; Width: 0.157inch; Height: 5mm; Packaging: Tape and Reel; Ratings: AEC-Q200; Max Operating Temperature: 125°C; Package Quantity: 1500; Mount: Through Hole; Capacitance: 10uF
LCD1 = CMP-1502-00586-2: as LED_Rows on sheet Button Decoding; Termination: Through Hole; Contact Material: Copper; Height: 3.3mm; Width: 10.2mm; RoHS: Compliant; REACH SVHC: Unknown; Max Operating Temperature: 105°C; Contact Plating: Tin; Lead Free: Lead Free; Contact Gender: Male; Lead Pitch: 2.54mm; Flammability Rating: UL94 V-0; Packaging: Bulk; Housing Material: Nylon; Number of Pins: 4; Number of Contacts: 4; Color: Beige; Number of Rows: 1; Orientation: Vertical; Contact Mating Length: 7.493mm; Mount: Through Hole; Min Operating Temperature: -40°C; Voltage Rating: 250V; Fastening Type: Friction; Length: 10.16mm
Menu_Input = CMP-1502-01076-2: NexarPartId: 32855533; Current Rating: 3A; Connector Type: Male Pin; Voltage Rating: 250V; Number of Contacts: 8; Pitch: 2.54mm; Contact Resistance: 20mΩ; Gender: Male; REACH SVHC: Unknown; Number of Rows: 1; Mount: Through Hole; Termination: Solder; Number of Pins: 8; Number of Positions: 8; Height: 8.54mm; Contact Mating Length: 5.9944mm; Orientation: Vertical; Operating Supply Voltage: 250V; Min Operating Temperature: -40°C; Max Operating Temperature: 105°C; Packaging: Bulk; Color: Black; Lead Pitch: 2.54mm; RoHS: Compliant; Contact Material: Copper; Contact Plating: Gold
On/Off/BAT = CMP-1024-00331-1: 0.025" SQ Post Header, Through-hole, Vertical, -55 to 125 degC, 2.54 mm Pitch, 3-Pin, Male, RoHS; Manufacturer: Samtec; Pitch: 2.54 mm; DatasheetVersion: F-214; ComponentLink1Description: Manufacturer URL; ComponentLink3URL: http://www.samtec.com/documents/webfiles/cpdf/TSW-XXX-XX-XXX-X-XX-XXX-MKT.pdf; Mounting Technology: Through-hole; PackageDescription: .025[0.64] SQ. Post Terminal Strip Assembly; Temperature Range: -55 to 125 degC; ComponentLink3Description: Package Specification; Orientation: Vertical; PartNumber: TSW-103-07-F-S; RoHS: True; PackageVersion: DM, 8/1988; ComponentLink2Description: Datasheet; ComponentLink1URL: http://www.samtec.com; ComponentLink2URL: http://www.samtec.com/documents/webfiles/pdf/TSW_TH.PDF; PackageReference: TSW-103-07-X-S
PWR/GND = CMP-1502-01064-2: NexarPartId: 32855522; Pitch: 2.54mm; Number of Contacts: 4; Contact Resistance: 20mΩ; Gender: Male; Current Rating: 3A; Connector Type: Male Pin; Voltage Rating: 250V; Lead Free: Lead Free; Contact Plating: Gold; Max Operating Temperature: 105°C; Packaging: Bulk; Height: 8.89mm; Orientation: Vertical; Contact Mating Length: 5.9944mm; Contact Material: Copper; Lead Pitch: 2.54mm; Min Operating Temperature: -40°C; Termination: Solder; Color: Black; Number of Rows: 1; REACH SVHC: Unknown; RoHS: Compliant; Mount: Through Hole; Number of Positions: 4; Number of Pins: 4; Operating Supply Voltage: 250V
R37-R40 = CMP-1659-00013-4: as R1 on sheet MIDI; Mount: Surface Mount; ComponentLink1Description: Manufacturer URL; ComponentLink2URL: http://www.yageo.com/documents/recent/PYu-RC_Group_51_RoHS_L_04.pdf; Pins: 2; Length: 2 mm; Min Operating Temperature: -55 degC; Height: 0.5 mm; Mounting Technology: Surface Mount; RoHSCompliant: true; REACH SVHC: No SVHC; ComponentLink1URL: http://www.yageo.com/; Max Operating Temperature: 155 degC; PackageReference: 0805; DatasheetVersion: Rev. 4, 02/2016; Package Quantity: 5000; Packaging: Tape and Reel; ComponentLink2Description: Datasheet; PackageDescription: 2-Pin Surface Mounted Device, Body 2 x 1.25 mm
Teensy_Pins = CMP-1502-01080-2: as But._Col on sheet Button Decoding; Number of Rows: 1; Number of Pins: 9; Termination: Solder; REACH SVHC: Unknown; Orientation: Vertical; Contact Plating: Gold; Mount: Through Hole; RoHS: Compliant; Number of Positions: 9; Color: Black; Lead Pitch: 2.54mm; Packaging: Bulk; Contact Mating Length: 5.9944mm; Contact Material: Copper
VR1 = CMP-0062-02519-4: IC REG LINEAR 5V 500MA TO220-3; Manufacturer: Texas Instruments; Manufacturer Part Number: LM2937ET-5.0/NOPB; Standoff Height: 3.3mm; Max Supply Voltage: 26V; Min Supply Voltage: 6V; Max Junction Temp: +125°C; Number Of Outputs: 1; Accuracy Percentage: 5%; Dropout Voltage: 0.5V; Output Type: Fixed; Nominal Supply Current: 2-10mA; Output Voltage: 5V; Digikey Description: IC REG LINEAR 5V 500MA TO220-3; Temperature: -40°C to +125°C; Category: IC; Temperature Range High: +125°C; ComponentLink2Description: Datasheet; Package: NDE0003B; ComponentLink2URL: http://www.ti.com/lit/ds/symlink/lm2937.pdf; Ipc Land Pattern Name: TO-220; Height: 19.55mm; Device Class L3: Voltage Regulators - Linear; Automotive: No; Octopart: https://octopart.com/lm2937et-5.0%2Fnopb-texas+instruments-24813532; Device Class L1: Integrated Circuits (ICs); Output Current: 500mA; RoHS: TRUE; Temperature Range Low: -40°C; Lead Free: Yes; Device Class L2: Power Management ICs
VR2 = CMP-0244-00470-1: Fixed Low Drop Positive Voltage Regulator, 3.3V, 3-Pin TO-220; PackageVersion: ver3.0; PackageDescription: TO, Thru-Hole, Vertical, Heatsink Mounted; 3 In-Line Leads; Pitch 2.54 mm; ComponentLink1Description: Manufacturer URL; ComponentLink3URL: http://www.st.com/internet/com/TECHNICAL_RESOURCES/TECHNICAL_LITERATURE/PACKAGE_INFORMATION/CD00004649.pdf; PackageReference: TO220; ComponentLink2URL: http://www.st.com/internet/com/TECHNICAL_RESOURCES/TECHNICAL_LITERATURE/DATASHEET/CD00000544.pdf; ComponentLink3Description: Package Specification; ComponentLink2Description: Datasheet; ComponentLink1URL: http://www.st.com; DatasheetVersion: 1/11/2011

## Sheet Mixer to LP-HP Filter.SchDoc: Audio_Moduloop - Mixer/Filters
size A; Date: 2/27/2024; DrawnBy: Team 28: Ryan Gordon, Conor Curtin, Evan Roveili, Shawn Colby; DocumentNumber: 4; Revision: V1; SheetNumber: 4; SheetTotal: 7
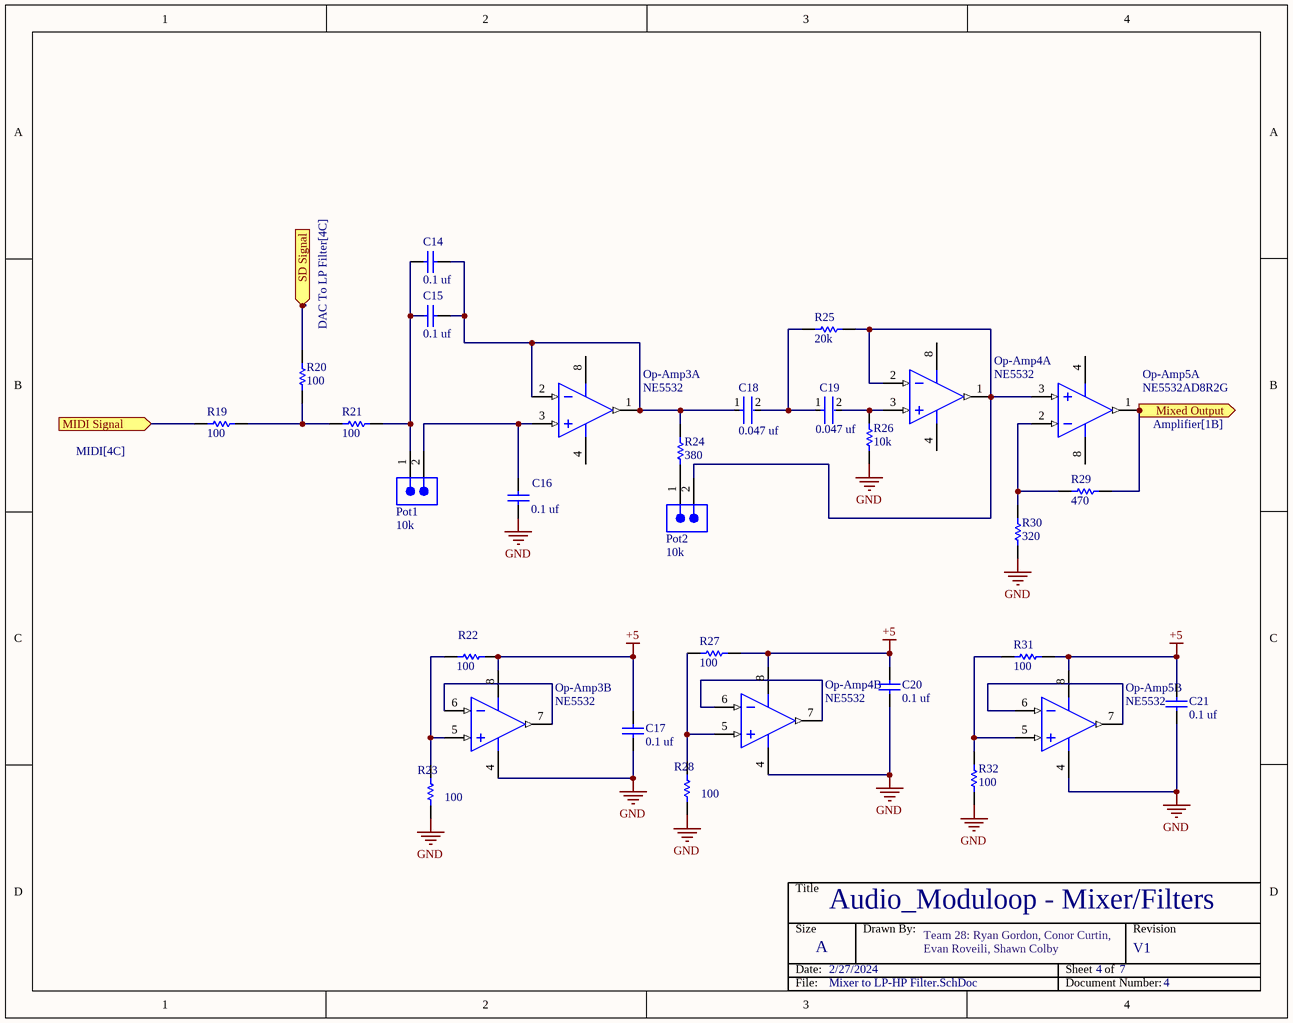
[diagram p6: Mixer to LP-HP Filter.SchDoc]

### Parts
C14  0.1 uf  [AVX-SA115C104KAR]
C15  0.1 uf  [AVX-SA115C104KAR]
C16  0.1 uf  [AVX-SA115C104KAR]
C17  0.1 uf  [AVX-SA115C104KAR]
C18  0.047 uf  [FP-RCE1K1-2_5-MFG]
C19  0.047 uf  [FP-RCE1K1-2_5-MFG]
C20  0.1 uf  [AVX-SA115C104KAR]
C21  0.1 uf  [AVX-SA115C104KAR]
Op-Amp3  NE5532  [ONSC-SOIC-8-751-07_V]  (parts A,B of 2)
Op-Amp4  NE5532  [ONSC-SOIC-8-751-07_V]  (parts A,B of 2)
Op-Amp5  NE5532AD8R2G  [ONSC-SOIC-8-751-07_V]  (parts A,B of 2)
Pot1  10k  [61300211121]
Pot2  10k  [61300211121]
R19  100  [RESC2013X60X40ML20T25]
R20  100  [RESC2013X60X40ML20T25]
R21  100  [RESC2013X60X40ML20T25]
R22  100  [RESC2013X60X40ML20T25]
R23  100  [RESC2013X60X40ML20T25]
R24  380  [RESC2013X60X40LL20T25]
R25  20k  [RESC2013X60X35NL10T20]
R26  10k  [RESC2013X60X35NL10T20]
R27  100  [RESC2013X60X40ML20T25]
R28  100  [RESC2013X60X40ML20T25]
R29  470  [RESC2013X60X40NL20T25]
R30  320  [RESC2013X60X40LL20T25]
R31  100  [RESC2013X60X40ML20T25]
R32  100  [RESC2013X60X40ML20T25]

### Ports
MIDI Signal (in, see MIDI[4C]), Mixed Output (out, see Amplifier[1B]), SD Signal (in, see DAC To LP Filter[4C])

### Nets
+5: C17.2 C20.2 C21.2 Op-Amp3.8(V+) Op-Amp4.8(V+) Op-Amp5.8(V+) R22.1 R27.1 R31.1
GND: C16.1 C17.1 C20.1 C21.1 Op-Amp3.4(V-) Op-Amp4.4(V-) Op-Amp5.4(V-) R23.1 R26.2 R28.1 R30.2 R32.2
NetC3_1: R19.1 ; port MIDI Signal
NetC11_1: R20.1 ; port SD Signal
NetC14_1: C14.1 C15.1 Pot1.1 R21.1
NetC14_2: C14.2 C15.2 C18.1 Op-Amp3.1(OUTA) Op-Amp3.2(INA-) R24.1
NetC16_2: C16.2 Op-Amp3.3(INA+) Pot1.2
NetC18_2: C18.2 C19.1 R25.1
NetC19_2: C19.2 Op-Amp4.3(INA+) R26.1
NetC22_2: Op-Amp5.1(OUTA) R29.2 ; port Mixed Output
NetOp-Amp3_5: Op-Amp3.5(INB+) R22.2 R23.2
NetOp-Amp3_6: Op-Amp3.6(INB-) Op-Amp3.7(OUTB)
NetOp-Amp4_1: Op-Amp4.1(OUTA) Op-Amp4.2(INA-) Op-Amp5.3(INA+) Pot2.2 R25.2
NetOp-Amp4_5: Op-Amp4.5(INB+) R27.2 R28.2
NetOp-Amp4_6: Op-Amp4.6(INB-) Op-Amp4.7(OUTB)
NetOp-Amp5_2: Op-Amp5.2(INA-) R29.1 R30.1
NetOp-Amp5_5: Op-Amp5.5(INB+) R31.2 R32.1
NetOp-Amp5_6: Op-Amp5.6(INB-) Op-Amp5.7(OUTB)
NetPot2_1: Pot2.1 R24.2
NetR19_2: R19.2 R20.2 R21.2

### Notes on the sheet
- Title
- Size
- Date:
- A
- Drawn By:
- Sheet    of
- Revision
- File:
- Document Number:

### Library data of the parts
C14-C17 C20 C21 = CMP-2000-07029-1: as C5 on sheet MIDI; Category: Capacitors; Package Description: 2-Pin Axial Lead, Dia 3.05 mm, Body Length 4.32 mm; Standard Package: 1; Mounting Technology: ThroughHole; Ratings: -; Datasheet Version: 06/2007; Voltage - Rated: 50V; Tolerance: ±10%; Package Reference: SA115C104KAR; Packaging: -; Lead Style: -; Size / Dimension: 0.120"Diax0.170"L(3.05mmx4.32mm); Mounting Type: ThroughHole; Operating Temperature: -55°C~125°C; Datasheet URL: https://datasheet.ciiva.com/27051/1074183-27051369.pdf; Applications: GeneralPurpose; Thickness (Max): -; Lead Spacing: -; Height - Seated (Max): -; Family: CeramicCapacitors; Package / Case: Axial; Features: -; Series: SpinGuard®SA; Manufacturer URL: http://www.avx.com/
C18 C19 = CMP-06035-044450-1: Cap Ceramic Monolithic 47nF 100V 10% Thru-Hole Bulk; Dielectric: X7R; Lead/Base Style: Formed Leads; Lead Diameter: 0.5mm; Tolerance: 10%; Width: 0.098inch; Max Operating Temperature: 125°C; Case/Package: Radial; Min Operating Temperature: -55°C; Ratings: AEC-Q200; Voltage Rating (DC): 100V; Packaging: Tape and Reel; Termination: Radial; Resistor Type: Ceramic; Voltage Rating: 100V; Height: 3.5mm; Capacitance: 47nF; Mount: Through Hole; Length: 0.157inch; Package Quantity: 2000; Height - Seated (Max): 0.138inch; Lead Pitch: 0.197inch
Op-Amp3 Op-Amp4 = CMP-1310-00252-1: as Op-Amp1 on sheet MIDI; PackageVersion: Rev. AK, 02/2011; ComponentLink2URL: http://www.onsemi.cn/pub_link/Collateral/NE5532-D.PDF; RoHS: TRUE; PackageReference: SOIC-8-751-07; ComponentLink2Description: Datasheet; PackageDescription: 8-Pin Small Outline Integrated Circuit, Body 4.9 x 3.9 mm, Pitch 1.27 mm; ComponentLink3URL: http://www.onsemi.com/pub_link/Collateral/751-07.PDF; ComponentLink1Description: Manufacturer URL; DatasheetVersion: Rev. 2; Packing: Tape and Reel; ComponentLink1URL: http://www.onsemi.com/; ComponentLink3Description: Package Specification; Mounting Technology: Surface Mount
Op-Amp5 = CMP-1310-00252-1: Internally Compensated Dual Low Noise Operational Amplifier, 6 to 40 V, 0 to 70 degC, 8-Pin SOIC, Pb-Free, Tape and Reel; Manufacturer: On Semiconductor; SR Typ (V/uS): 9; VCC Min (V): 6; VCC Max (V): 40; GBW Typ (MHz): 10; PackageVersion: Rev. AK, 02/2011; ComponentLink2URL: http://www.onsemi.cn/pub_link/Collateral/NE5532-D.PDF; RoHS: TRUE; PackageReference: SOIC-8-751-07; ComponentLink2Description: Datasheet; PackageDescription: 8-Pin Small Outline Integrated Circuit, Body 4.9 x 3.9 mm, Pitch 1.27 mm; ComponentLink3URL: http://www.onsemi.com/pub_link/Collateral/751-07.PDF; ComponentLink1Description: Manufacturer URL; DatasheetVersion: Rev. 2; Packing: Tape and Reel; ComponentLink1URL: http://www.onsemi.com/; ComponentLink3Description: Package Specification; Mounting Technology: Surface Mount; PartNumber: NE5532AD8R2G
Pot1 Pot2 = CMP-1712-00002-5: NexarPartId: 20081794; Operating Supply Voltage: 250V; Current Rating: 3A; Gender: Male; Number of Contacts: 2; Pitch: 2.54mm; Connector Type: Male Pin; Contact Resistance: 20mΩ; Contact Plating: Gold; Contact Material: Copper; Number of Pins: 2; Min Operating Temperature: -40°C; Packaging: Bulk; Lead Pitch: 2.54mm; Mount: Through Hole; Orientation: Vertical; RoHS: Compliant; REACH SVHC: No SVHC; Height: 8.94mm; Termination: Through Hole; Number of Positions: 2; Contact Mating Length: 5.9944mm; Color: Black; Contact Gender: Male; Number of Rows: 1; Housing Material: PBT; Lead Free: Lead Free; Voltage Rating: 250V; Max Operating Temperature: 125°C
R19-R23 R27 R28 R31 R32 = CMP-2001-00580-1: as R10 on sheet MIDI
R24 R30 = CMP-2001-00628-1: Manufacturer: Panasonic; Part Number: ERA6AEB331V
R25 R26 = CMP-1659-00013-4: as R1 on sheet MIDI; Mount: Surface Mount; ComponentLink1Description: Manufacturer URL; ComponentLink2URL: http://www.yageo.com/documents/recent/PYu-RC_Group_51_RoHS_L_04.pdf; Pins: 2; Length: 2 mm; Min Operating Temperature: -55 degC; Height: 0.5 mm; Mounting Technology: Surface Mount; RoHSCompliant: true; REACH SVHC: No SVHC; ComponentLink1URL: http://www.yageo.com/; Max Operating Temperature: 155 degC; PackageReference: 0805; DatasheetVersion: Rev. 4, 02/2016; Package Quantity: 5000; Packaging: Tape and Reel; ComponentLink2Description: Datasheet; PackageDescription: 2-Pin Surface Mounted Device, Body 2 x 1.25 mm
R29 = CMP-2001-00643-1: Part Number: ERA6AEB471V; Manufacturer: Panasonic